# EAGLE design wf-np9202-carrier (EAGLE 9.6.1)
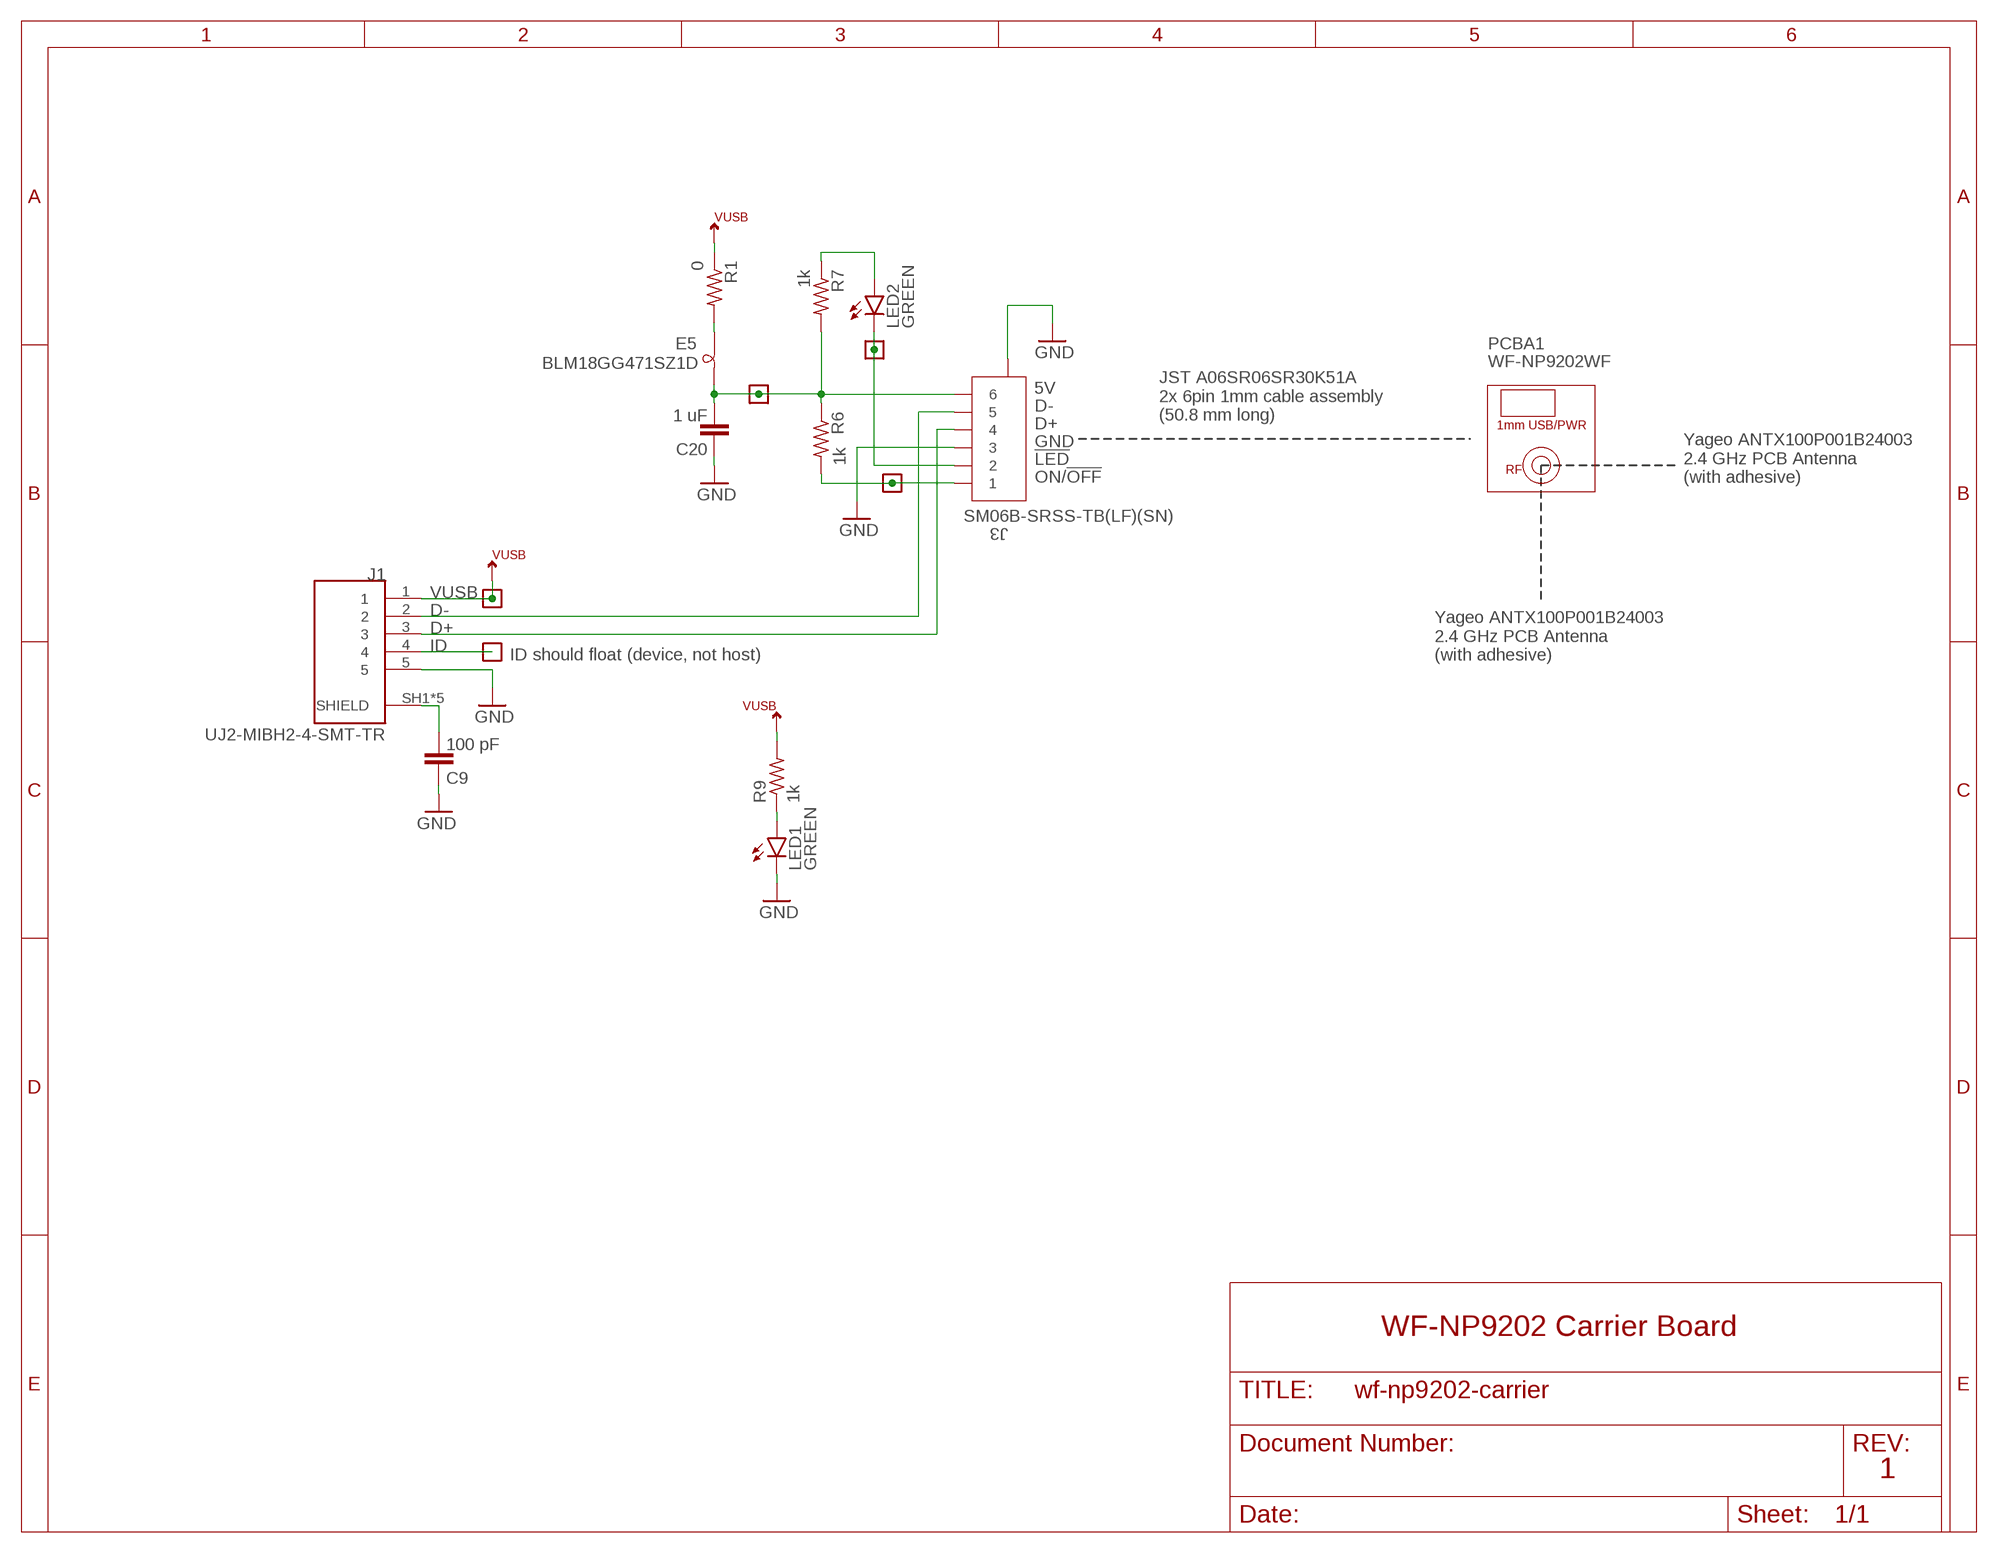
[diagram p0: schematic, sheet 1]

## Parts
C9  100 pF  C-EU0603-C-NOSILK  [.0603-C-NOSILK]
C20  1 uF  C-EU0603-B-NOSILK  [.0603-B-NOSILK]
E5  BLM18GG471SZ1D  L-BEAD-0603-B  [.0603-B]
ID  TEST-POINT-LARGE-SQUARE  [1X01]
J1  UJ2-MIBH2-4-SMT-TR  [CUI_UJ2-MIBH2-4-SMT-TR]
J3  SM06B-SRSS-TB(LF)(SN)  [CONN_SM06B-SRSS-TB_JST]
LED1  GREEN  LED-GREEN0603  [LED-0603]
LED2  GREEN  LED-GREEN0603  [LED-0603]
PCBA1  WF-NP9202WF  [WF-NP9202]
R1  0  R-US_0603-B-NOSILK  [.0603-B-NOSILK]
R6  1k  R-US_0603-B-NOSILK  [.0603-B-NOSILK]
R7  1k  R-US_0603-B-NOSILK  [.0603-B-NOSILK]
R9  1k  R-US_0603-B-NOSILK  [.0603-B-NOSILK]
TP1  TEST-POINT-LARGE-SQUARE  [1X01]
TP3  TEST-POINT-LARGE-SQUARE  [1X01]
TP4  TEST-POINT-LARGE-SQUARE  [1X01]
TP5  TEST-POINT-LARGE-SQUARE  [1X01]

## Nets
D+: J1.3 J3.4
D-: J1.2 J3.5
GND: C9.1 C20.1 J1.5 J3.3 J3.7 J3.8 LED1.C
ID: ID.1 J1.4
N$1: C9.2 J1.SH1(SHIELD) J1.SH2(SHIELD) J1.SH3(SHIELD) J1.SH4(SHIELD) J1.SH5(SHIELD)
N$10: LED1.A R9.1
N$29: C20.2 E5.2 J3.6 R6.1 R7.2 TP3.1
N$30: E5.1 R1.2
N$31: J3.1 R6.2 TP4.1
N$32: LED2.A R7.1
N$34: J3.2 LED2.C TP5.1
VUSB: J1.1 R1.1 R9.2 TP1.1

## Notes on the sheet
- 5V
- D-
- JST A06SR06SR30K51A
  2x 6pin 1mm cable assembly
  (50.8 mm long)
- D+
- GND
- !LED
- ON/!OFF
- Yageo ANTX100P001B24003
  2.4 GHz PCB Antenna
  (with adhesive)
- ID should float (device, not host)
- Yageo ANTX100P001B24003
  2.4 GHz PCB Antenna
  (with adhesive)
- WF-NP9202 Carrier Board
- 1

## Library data of the parts
C9 C20 = oresat-rcl:C-EU: CAPACITOR, European symbol
E5 = oresat-rcl:L-BEAD-*: Bead or Chip inductor ("ferrite bead") for EMI suppression
ID TP1 TP3-TP5 = oresat-misc:TEST-POINT-LARGE-SQUARE
J1 = J-CUI-UJ2-MIBH2-4-SMT-TR-USB-microB-RA-SMT+TH:UJ2-MIBH2-4-SMT-TR: Micro B Type 5 Pin Horizontal 30 µin Plating SMT USB Jack 2.0; CUI_PURCHASE_URL: https://www.cui.com/product/interconnect/usb-connectors/micro-b/uj2-mibh2-4-smt?utm_source=snapeda.com&utm_medium=referral&utm_campaign=snapedaBOM; DESCRIPTION: Micro B Type 5 Pin Horizontal 30 µin Plating SMT USB Jack 2.0; DIGI-KEY_PART_NUMBER: 102-4007-1-ND; DIGI-KEY_PURCHASE_URL: https://www.digikey.com/product-detail/en/cui-inc/UJ2-MIBH2-4-SMT-TR/102-4007-1-ND/6187929?utm_source=snapeda&utm_medium=aggregator&utm_campaign=symbol; MF: CUI Inc.; MP: UJ2-MIBH2-4-SMT-TR; PACKAGE: None
J3 = J-JST-SM06B-SRSS-TB(LF)(SN)-1mm-smt-6pin:SM06B-SRSS-TB(LF)(SN); BUILT_BY: EMA_Justin; COPYRIGHT: Copyright (C) 2018 Accelerated Designs. All rights reserved; DATASHEET: http://www.jst-mfg.com/product/pdf/eng/eSR.pdf; MANUFACTURER_PART_NUMBER: SM06B-SRSS-TB(LF)(SN); SOURCELIBRARY: JST_2020-02-24; VENDOR: JST
LED1 LED2 = SparkFun-LED:LED-GREEN: Green SMD LED Used in manufacturing of various products at SparkFun Packages: 0603 - SMD 0603 package [Product Link] <http://www.futureelectronics.com/en/technologies/semiconductors/optoelectronics/leds/Pages/9894312-LTST-C190GKT.aspx?CrossPart=HSMG-C190&IM=0> LilyPad 1206 - SMD1206 LilyPad package [Product Link] <http://www.futureelectronics.com/en/Technologies/Product.aspx?ProductID=IN150NGHARVATEKCORPORATION2049943&IM=0> 1206 - SMD1206 package [Product Link] <http://www.futureelectronics.com/en/technologies/semiconductors/optoelectronics/leds/Pages/8315665-LTST-C150KGKT.aspx?IM=0> 1206 Bottom Mount -SMD 1206 Bottom Mount [Product Link] <http://www.digikey.com/product-detail/en/lite-on-inc/LTST-C230KGKT/160-1456-1-ND/386854> SparkFun Products: Pro Mini 328 -5V <https://www.sparkfun.com/products/821> RedBoard <https://www.sparkfun.com/products/12757> MP3 Trigger <https://www.sparkfun.com/products/13720> Makey Makey <https://www.sparkfun.com/products/11076>; PROD_ID: DIO-00821
PCBA1 = PCBA-WF-NP9202-wifi-adapter:WF-NP9202
R1 R6 R7 R9 = oresat-rcl:R-US_: RESISTOR, American symbol

## Net classes
2 RF: clearance 0.75 mm

## Board
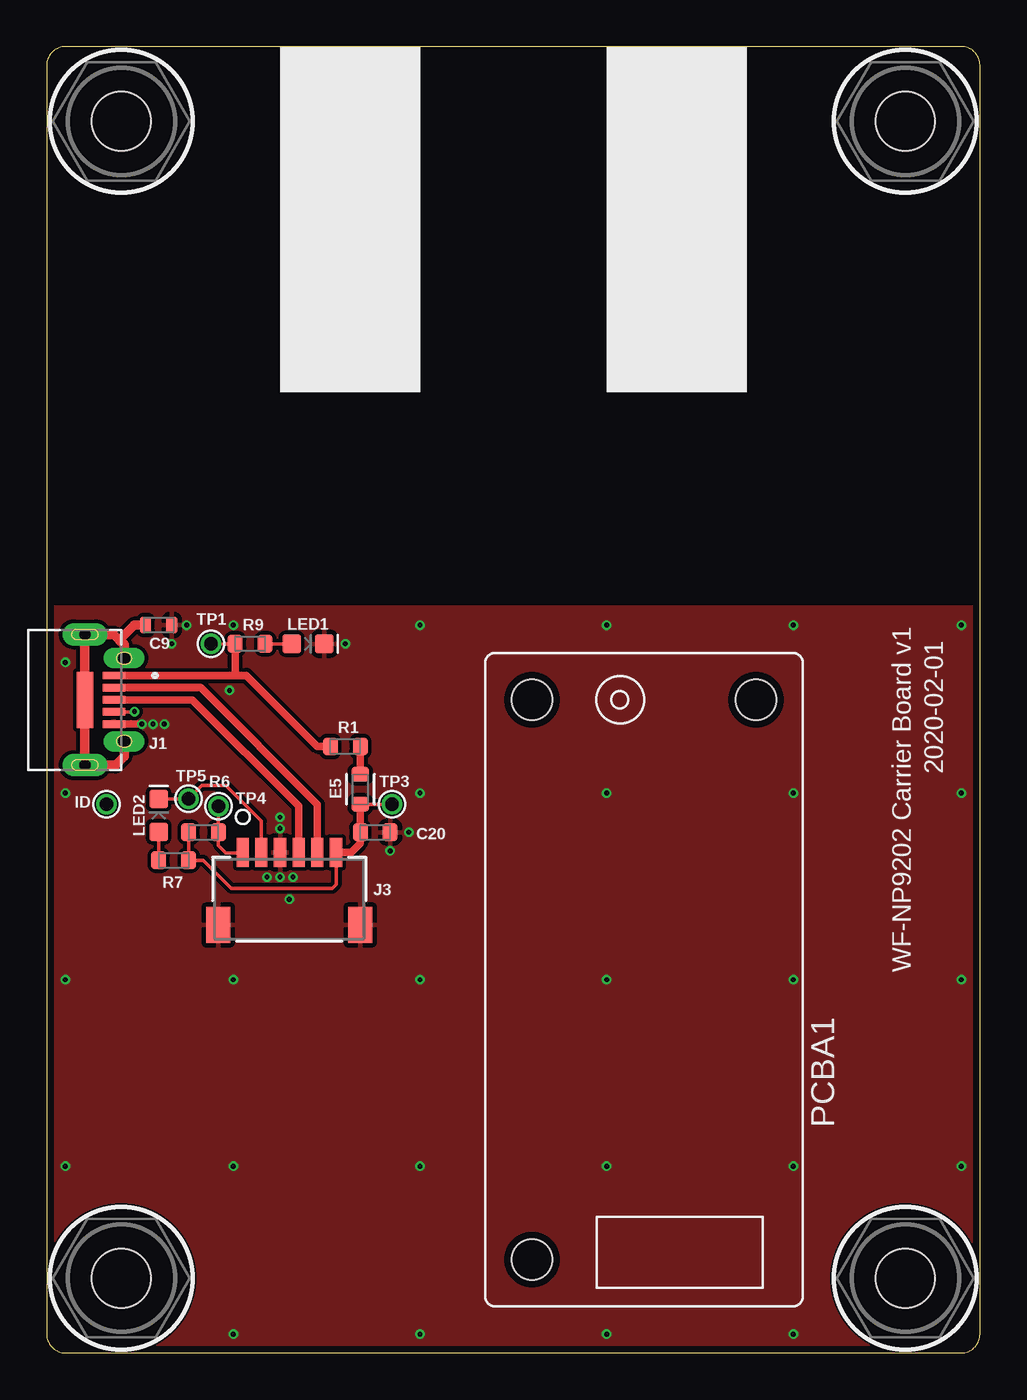
[diagram p1: board, top side]
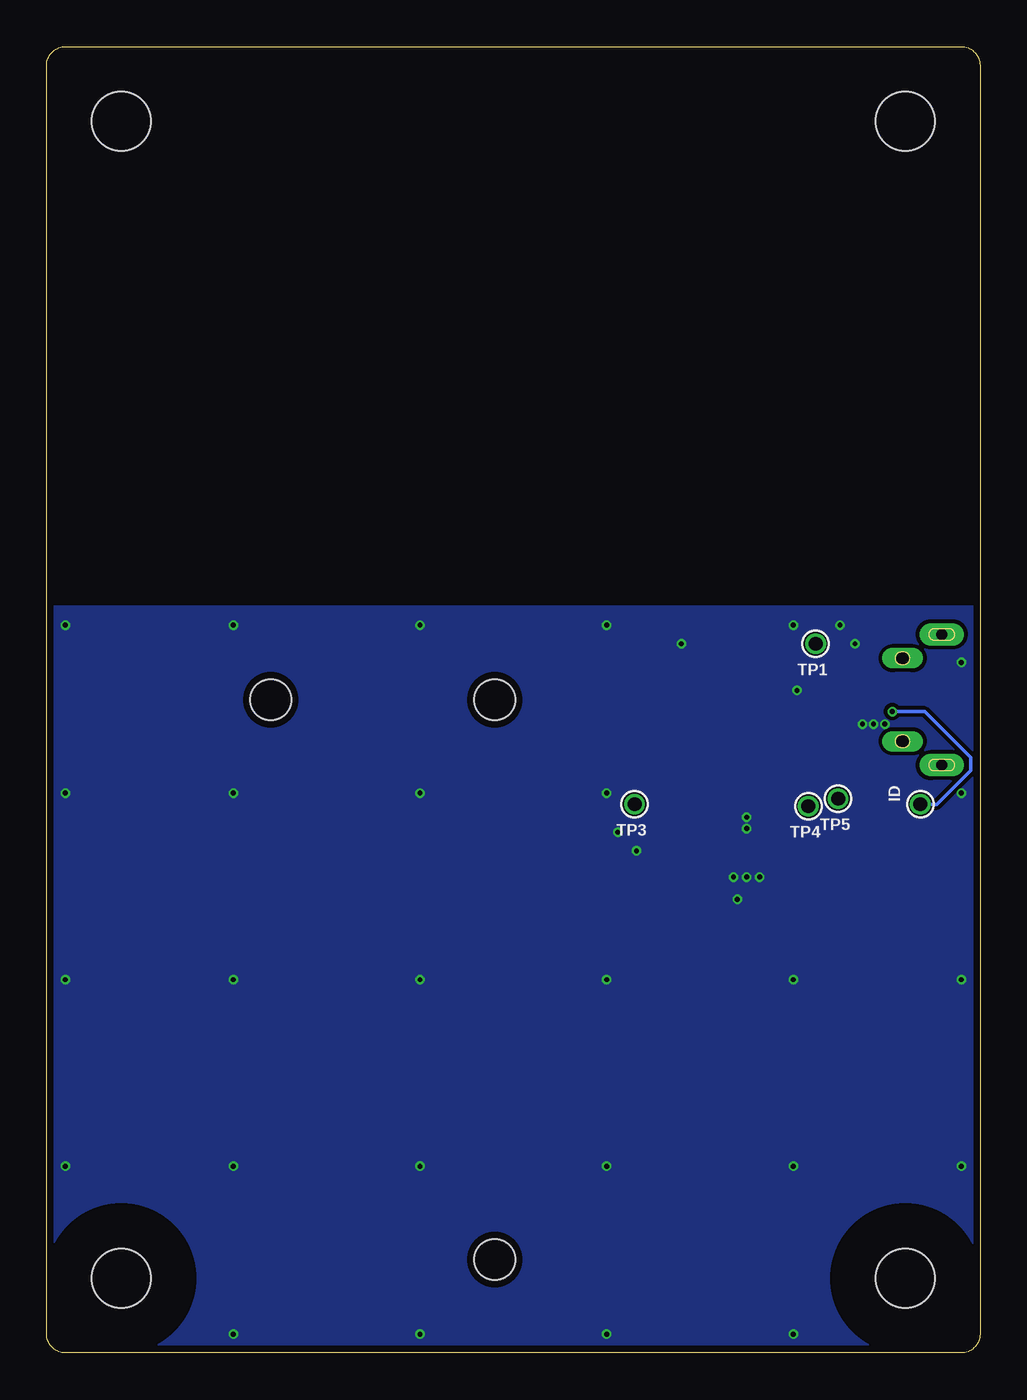
[diagram p2: board, bottom side, seen from below]

Size 50 x 70 mm. Coordinates in mm from the lower left corner, seen from the top.
Outline: 0,69 0,1 arc90 1,0 49,0 arc90 50,1 50,69 arc90 49,70 1,70 arc90 0,69
Copper layers (1*16): Top 0.035559375mm / dielectric 1.6mm / Bottom 0.035559375mm
Design rules "oshpark-2layer-tented": minimum track width 6mil, minimum drill 10mil, track to track 6mil, track to pad 6mil, pad to pad 6mil, via to via 6mil, smd to smd 6mil, copper to edge 15mil, drill to drill 6mil, minimum pad ring 5mil, minimum via ring 5mil, stop-mask expansion 2.5mil, vias tented up to drill 20mil, thermal gap 10mil
tRestrict: 1 lines

### Footprints (pad centres in the part's own frame; a part is rotated, then mirrored left to right if it is on the bottom)
.0603-C-NOSILK = smd 0.6 x 0.9: 1 -0.7,0; 2 0.7,0
.0603-B-NOSILK = smd 0.8 x 0.95: 1 -0.8,0; 2 0.8,0
.0603-B = smd 0.8 x 0.95: 1 -0.8,0; 2 0.8,0
1X01 = drill 0.737 pad 1.1: 1 0,0
CUI_UJ2-MIBH2-4-SMT-TR = smd 0.4 x 1.2: 1 -1.3,2.1; 2 -0.65,2.1; 3 0,2.1; 4 0.65,2.1; 5 1.3,2.1 | drill 0.6 pad 1.2 long: SH1 -3.5,0.55; SH4 3.5,0.55 | drill 0.65 pad 1.1 long: SH2 -2.225,2.65; SH3 2.225,2.65 | smd 3 x 0.9: SH5 0,0.55
CONN_SM06B-SRSS-TB_JST = smd 0.66 x 1.549: 1 -2.5,2.507; 2 -1.5,2.507; 3 -0.5,2.507; 4 0.5,2.507; 5 1.5,2.507; 6 2.5,2.507 | smd 1.295 x 1.905: 7 -3.8,-1.368; 8 3.8,-1.368
LED-0603 = smd 1 x 1: A -0.877,0; C 0.877,0
WF-NP9202 = hole 2.2: -6,-15; 6,-15; 6,15
#4/.300-BARE+STD_NUT_OR_STAR_WASHER = hole 3.175: 0,0

### Placement (x,y rotation side)
C9  6,39 180 top
C20  17.6,27.9 180 top
E5  16.8,30.2 270 top
ID  3.2,29.4 90 top
J1  1.5,35 270 top
J3  13,24.3 0 top
LED1  14,38 0 top
LED2  6,28.8 90 top
PCBA1  32,20 180 top
R1  16,32.5 0 top
R6  8.4,27.9 0 top
R7  6.8,26.4 0 top
R9  10.9,38 180 top
TP1  8.8,38 0 top
TP3  18.5,29.4 0 top
TP4  9.2,29.3 0 top
TP5  7.6,29.7 0 top
U$1  [#4/.300-BARE+STD_NUT_OR_STAR_WASHER]  4,66 0 top
U$2  [#4/.300-BARE+STD_NUT_OR_STAR_WASHER]  46,66 0 top
U$3  [#4/.300-BARE+STD_NUT_OR_STAR_WASHER]  46,4 0 top
U$4  [#4/.300-BARE+STD_NUT_OR_STAR_WASHER]  4,4 0 top

### Tracks (layer width: path | path; a pad name or v marks a point on that pad's centre or on a via)
D+
  Top 0.4: J1.3 7.8,35 13.5,29.3 J3.4
D-
  Top 0.4: J1.2 8.25,35.65 14.5,29.4 J3.5
GND  (via drill 0.25)
  Top 0.4: J1.5 v5.1,33.7
  other vias: 16,38 7.5,39 6.7,38 5.7,33.7 12.5,28.1 12.5,28.7 12.5,25.5 11.8,25.5 13.2,25.5 6.3,33.7 18.4,26.9 1,20 1,10 10,1 20,1 30,1 40,1 49,10 49,20 49,30 49,39 40,39 30,39 20,39 10,39 1,37 1,30 10,10 20,10 30,10 40,10 40,20 30,20 20,20 10,20 19.4,27.9 30,30 40,30 20,30 13,24.3 9.8,35.5
  pour Top (isolate 0.2, rank 6): 50,0 50,40 0,40 0,0
  pour Bottom (isolate 0.2, rank 6): 50,0 50,40 0,40 0,0
ID  (via drill 0.25)
  Top 0.152: 4.7,34.35 v4.7,34.37
  Top 0.2: J1.4 4.7,34.35
  Bottom 0.2: ID.1 2.32,29.4 0.5,31.22 0.5,31.9 2.97,34.37 v4.7,34.37
N$1
  Top 0.5: J1.SH3 4.15,31.95 3.7,31.5 J1.SH4 J1.SH5 J1.SH1 3.6,38.5 3.9,38.2 | J1.SH2 4.15,37.95 3.9,38.2 | C9.2 4.7,39 3.9,38.2
N$10
  Top 0.2: R9.1 LED1.A
N$29
  Top 0.2: J3.6 15.5,25.1 15.3,24.9 9.9,24.9 8.4,26.4 R7.2 R6.1 | TP3.1 E5.2
  Top 0.4: E5.2 C20.2 16.8,27.3 16.31,26.81 J3.6
N$30
  Top 0.4: R1.2 E5.1
N$31
  Top 0.2: J3.1 9.6,26.8 9.2,27.2 R6.2 TP4.1
  Top 0.4: J3.1
N$32
  Top 0.2: LED2.A R7.1
N$34
  Top 0.2: J3.2 11.5,28.5 9.6,30.4 8.3,30.4 TP5.1 7.58,29.68 LED2.C
VUSB
  Top 0.2: R9.2 TP1.1
  Top 0.4: J1.1 10.1,36.3 | 10.1,36.3 R9.2 | 10.1,36.3 10.7,36.3 14.5,32.5 R1.1

### Text on the board
tPlace: 2020-02-01 | WF-NP9202 Carrier Board v1
tFinish: LNA-TP3M9037